# EAGLE design manual4 (EAGLE 9.0.1)
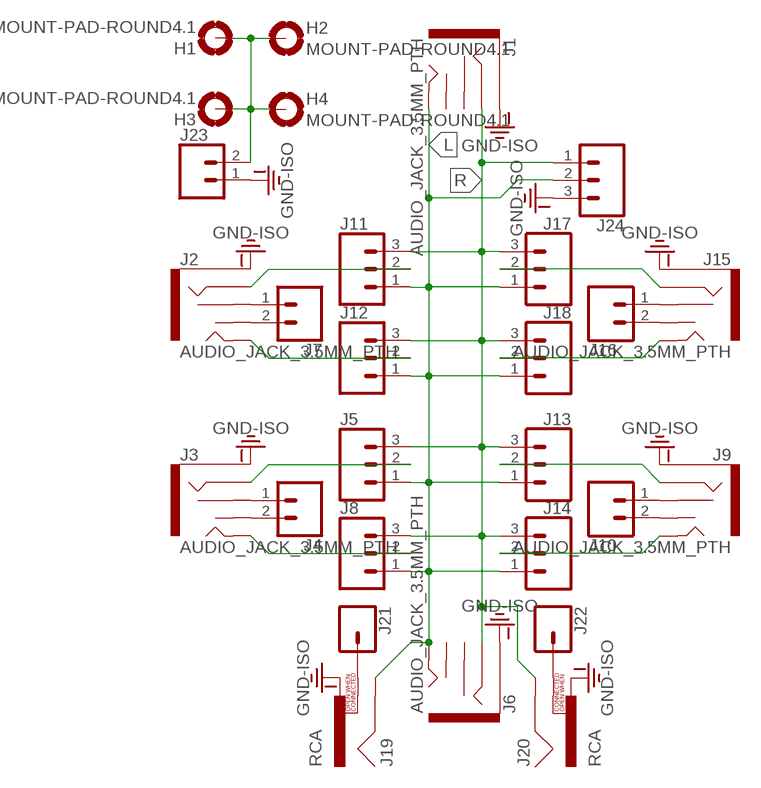
[diagram p0: schematic, sheet 1]

## Parts
H1  MOUNT-PAD-ROUND4.1  [4,1-PAD]
H2  MOUNT-PAD-ROUND4.1  [4,1-PAD]
H3  MOUNT-PAD-ROUND4.1  [4,1-PAD]
H4  MOUNT-PAD-ROUND4.1  [4,1-PAD]
J1  AUDIO_JACK_3.5MM_PTH  [AUDIO-JACK]
J2  AUDIO_JACK_3.5MM_PTH  [AUDIO-JACK]
J3  AUDIO_JACK_3.5MM_PTH  [AUDIO-JACK]
J4  CONN_02  [1X02]
J5  CONN_03  [1X03]
J6  AUDIO_JACK_3.5MM_PTH  [AUDIO-JACK]
J7  CONN_02  [1X02]
J8  CONN_03  [1X03]
J9  AUDIO_JACK_3.5MM_PTH  [AUDIO-JACK]
J10  CONN_02  [1X02]
J11  CONN_03  [1X03]
J12  CONN_03  [1X03]
J13  CONN_03  [1X03]
J14  CONN_03  [1X03]
J15  AUDIO_JACK_3.5MM_PTH  [AUDIO-JACK]
J16  CONN_02  [1X02]
J17  CONN_03  [1X03]
J18  CONN_03  [1X03]
J19  RCA  [RCA]
J20  RCA  [RCA]
J21  CONN_01  [1X01]
J22  CONN_01  [1X01]
J23  CONN_02  [1X02]
J24  CONN_03  [1X03]

## Nets
GND-ISO: J1.SLEEVE J2.SLEEVE J3.SLEEVE J6.SLEEVE J9.SLEEVE J15.SLEEVE J19.PIN J20.PIN J23.1 J24.3
L: J1.TIP J5.1 J6.TIP J8.1 J11.1 J12.1 J13.1 J14.1 J17.1 J18.1 J19.SHELL J24.2
N$1: J2.RSH J7.1
N$2: J2.TSH J7.2
N$3: J2.RING J11.2
N$4: J2.TIP J12.2
N$5: J3.RSH J4.1
N$6: J3.TSH J4.2
N$7: J3.RING J5.2
N$8: J3.TIP J8.2
N$9: J9.RSH J10.1
N$10: J9.TSH J10.2
N$11: J9.RING J13.2
N$12: J9.TIP J14.2
N$13: J15.RSH J16.1
N$14: J15.TSH J16.2
N$15: J15.RING J17.2
N$16: J15.TIP J18.2
N$17: J19.SWITCH J21.1
N$18: J20.SWITCH J22.1
N$19: H1.B4,1(MOUNT) H2.B4,1(MOUNT) H3.B4,1(MOUNT) H4.B4,1(MOUNT) J23.2
R: J1.RING J5.3 J6.RING J8.3 J11.3 J12.3 J13.3 J14.3 J17.3 J18.3 J20.SHELL J24.1
Unconnected: J1.RSH J1.TSH J6.RSH J6.TSH

## Library data of the parts
H1-H4 = holes:MOUNT-PAD-ROUND: MOUNTING PAD, round
J1-J3 J6 J9 J15 = SparkFun-Connectors:AUDIO_JACK_3.5MM: Audio Jack 3.5mm variants of PTH and SMT stereo audio jack with bypass switches. SparkFun Products: SparkFun SparkPunk Sound Kit <[https://www.sparkfun.com/products/11177]> - PTH MP3 Trigger <https://www.sparkfun.com/products/13720> -3.5mm SMD SparkFun PicoBoard <https://www.sparkfun.com/products/11888>- 2.5mm SMD; PROD_ID: CONN-08774; SF_ID: PRT-08032
J4 J7 J10 J16 J23 = SparkFun-Connectors:CONN_02: Multi connection point. Often used as Generic Header-pin footprint for 0.1 inch spaced/style header connections On any of the 0.1 inch spaced packages, you can populate with these: Break Away Headers - Straight <https://www.sparkfun.com/products/116> (PRT-00116) Break Away Male Headers - Right Angle <https://www.sparkfun.com/products/553> (PRT-00553) Female Headers <https://www.sparkfun.com/products/115> (PRT-00115) Break Away Headers - Machine Pin <https://www.sparkfun.com/products/117> (PRT-00117) Break Away Female Headers - Swiss Machine Pin <https://www.sparkfun.com/products/743> (PRT-00743) For SCREWTERMINALS and SPRING TERMINALS visit here: Screw Terimnals on SparkFun.com <https://www.sparkfun.com/search/results?term=Screw+Terminals> (5mm/3.5mm/2.54mm spacing) This device is also useful as a general connection point to wire up your design to another part of your project. Our various solder wires solder well into these plated through hole pads. Hook-Up Wire - Assortment (Stranded, 22 AWG) <https://www.sparkfun.com/products/11375> (PRT-11375) Hook-Up Wire - Assortment (Solid Core, 22 AWG) <https://www.sparkfun.com/products/11367> (PRT-11367) View the entire wire category on our website here <https://www.sparkfun.com/categories/141> Special notes: Molex polarized connector foot print use with: PRT-08233 with associated crimp pins and housings. 2.54_SCREWTERM for use with PRT-10571. 3.5mm Screw Terminal footprints for PRT-08084 5mm Screw Terminal footprints for use with PRT-08432
J5 J8 J11-J14 J17 J18 J24 = SparkFun-Connectors:CONN_03: Multi connection point. Often used as Generic Header-pin footprint for 0.1 inch spaced/style header connections On any of the 0.1 inch spaced packages, you can populate with these: Break Away Headers - Straight <https://www.sparkfun.com/products/116> (PRT-00116) Break Away Male Headers - Right Angle <https://www.sparkfun.com/products/553> (PRT-00553) Female Headers <https://www.sparkfun.com/products/115> (PRT-00115) Break Away Headers - Machine Pin <https://www.sparkfun.com/products/117> (PRT-00117) Break Away Female Headers - Swiss Machine Pin <https://www.sparkfun.com/products/743> (PRT-00743) Stackable Header - 3 Pin (Female, 0.1") <https://www.sparkfun.com/products/13875> (PRT-13875) For SCREWTERMINALS and SPRING TERMINALS visit here: Screw Terimnals on SparkFun.com <https://www.sparkfun.com/search/results?term=Screw+Terminals> (5mm/3.5mm/2.54mm spacing) This device is also useful as a general connection point to wire up your design to another part of your project. Our various solder wires solder well into these plated through hole pads. Hook-Up Wire - Assortment (Stranded, 22 AWG) <https://www.sparkfun.com/products/11375> (PRT-11375) Hook-Up Wire - Assortment (Solid Core, 22 AWG) <https://www.sparkfun.com/products/11367> (PRT-11367) View the entire wire category on our website here <https://www.sparkfun.com/categories/141> Special notes: Molex polarized connector foot print use with SKU : PRT-08232 with associated crimp pins and housings.
J19 J20 = SparkFun-Connectors:RCA: RCA Jack connector This is a right angle RCA jack connecotr. Commonly used for video or audio. Here is the connector we sell at SparkFun: RCA Jack <https://www.sparkfun.com/products/8631> (PRT-08631) Datasheet <http://www.sparkfun.com/datasheets/Prototyping/Connectors/RCA-Jack.pdf> It is not used on any active designs, however it was used on a couple retired products: RCA Jack Breakout [RETIRED] <https://www.sparkfun.com/products/8826> (PRT-08826) SparkFun On Screen Display Breakout - MAX7456 [RETIRED] <https://www.sparkfun.com/products/9168> (BOB-09168) You may also be interested in a cable: RCA Video Cable - 6' <https://www.sparkfun.com/products/11573> (CAB-11573); PROD_ID: CONN-09081; SF_ID: PRT-08631
J21 J22 = SparkFun-Connectors:CONN_01: Single connection point. Often used as Generic Header-pin footprint for 0.1 inch spaced/style header connections On any of the 0.1 inch spaced packages, you can populate with these: Break Away Headers - Straight <https://www.sparkfun.com/products/116> (PRT-00116) Break Away Male Headers - Right Angle <https://www.sparkfun.com/products/553> (PRT-00553) Female Headers <https://www.sparkfun.com/products/115> (PRT-00115) Break Away Headers - Machine Pin <https://www.sparkfun.com/products/117> (PRT-00117) Break Away Female Headers - Swiss Machine Pin <https://www.sparkfun.com/products/743> (PRT-00743) This device is also useful as a general connection point to wire up your design to another part of your project. Our various solder wires solder well into these plated through hole pads. Hook-Up Wire - Assortment (Stranded, 22 AWG) <https://www.sparkfun.com/products/11375> (PRT-11375) Hook-Up Wire - Assortment (Solid Core, 22 AWG) <https://www.sparkfun.com/products/11367> (PRT-11367) View the entire wire category on our website here <https://www.sparkfun.com/categories/141> Special notes: SMTSO-256-ET is a "flush mount" nut for a 4-40 screw. We mostly use this on specialty testbeds; it is a nice way to connect hardware to your PCB at an adjustable hieght. Also note, the SNAP packages are for using a snappable style connector. We sell a baggie of snaps and they are also used on two LilyPad designs: Snap Assortment - 30 pack (male and female) <https://www.sparkfun.com/products/11347> (DEV-11347) LilyPad Arduino SimpleSnap <https://www.sparkfun.com/products/10941> (DEV-10941) LilyPad SimpleSnap Protoboard <https://www.sparkfun.com/products/10940> (DEV-10940)

## Board
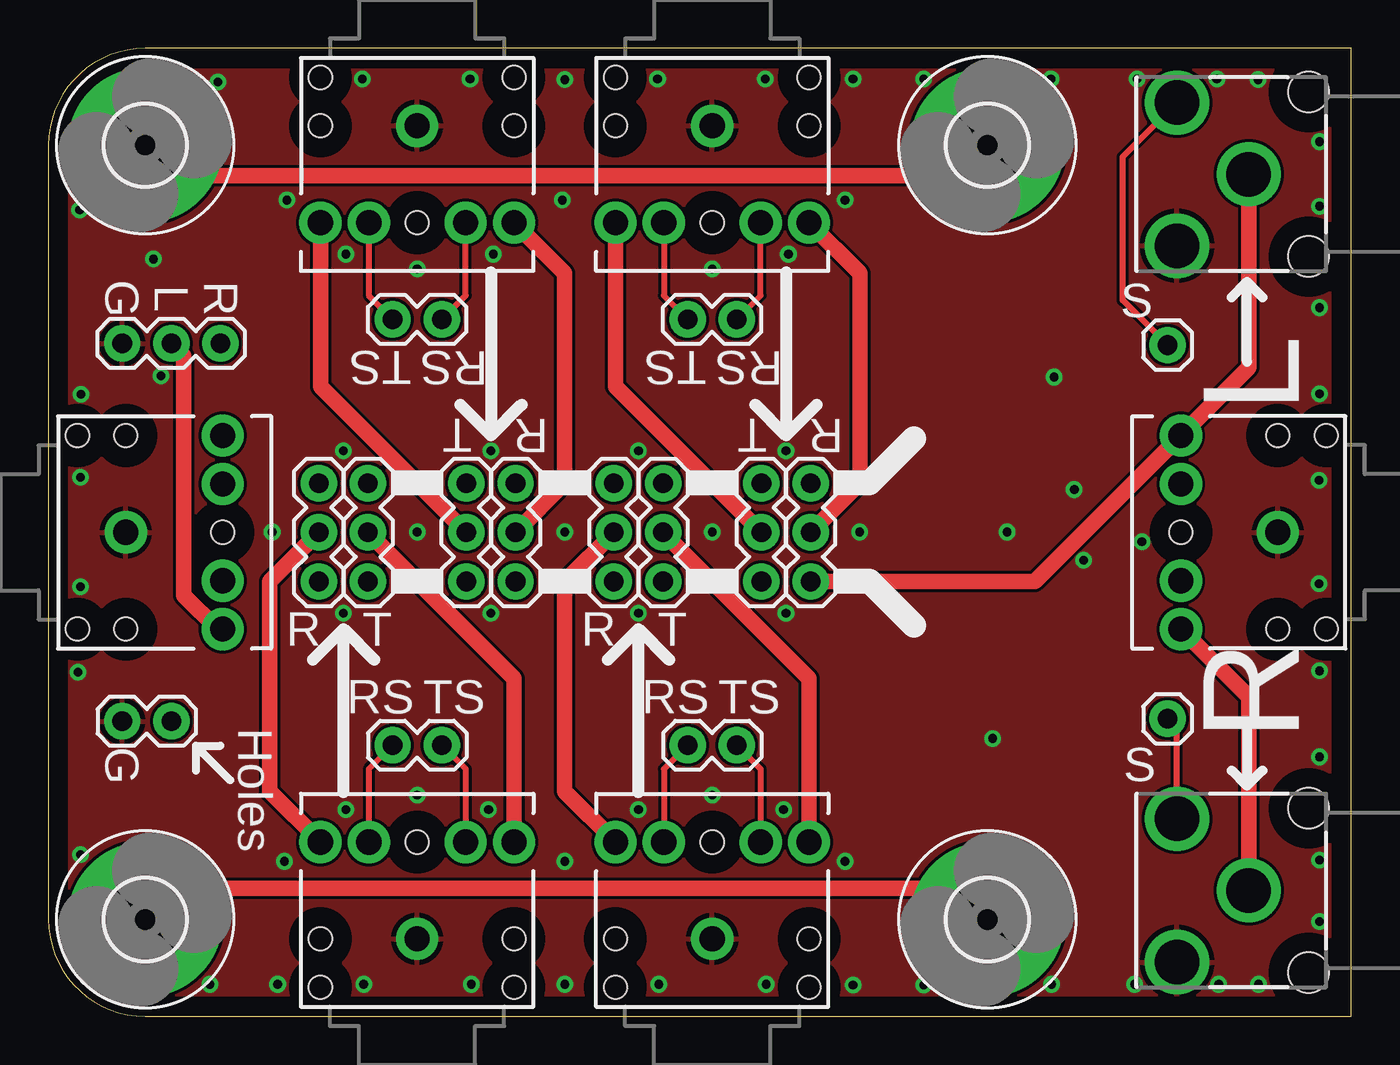
[diagram p1: board, top side]
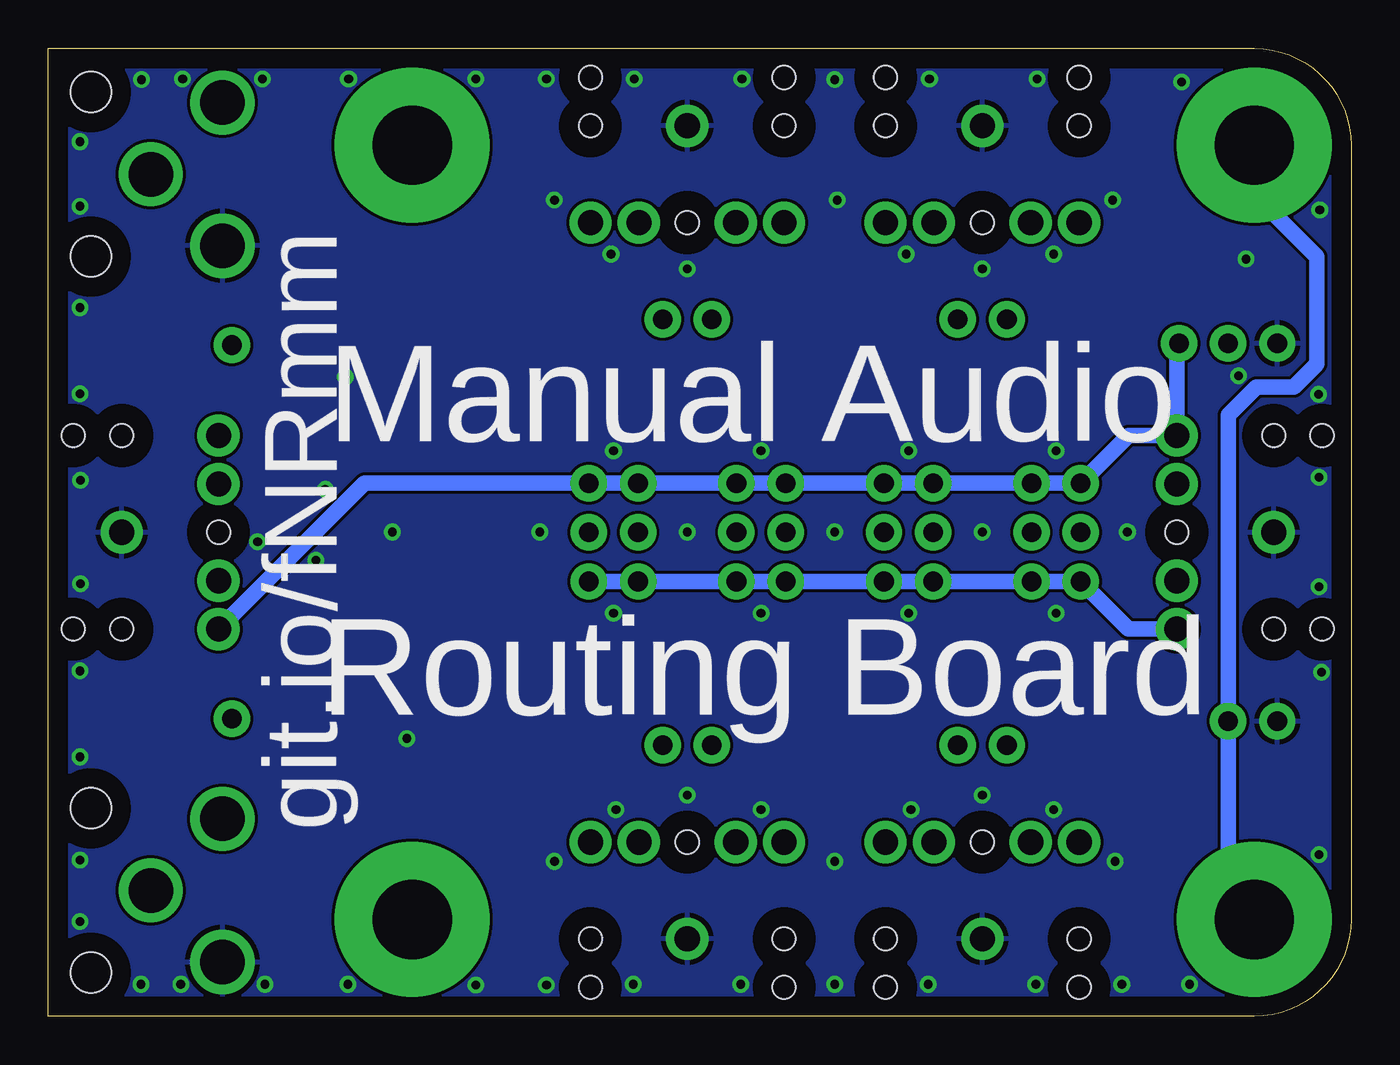
[diagram p2: board, bottom side, seen from below]

Size 67.29 x 50 mm. Coordinates in mm from the lower left corner, seen from the top.
Outline: 0,45 0,5 arc90 5,0 67.29,0 67.29,50 5,50 arc90 0,45
Copper layers (1*16): Top 0.035mm / dielectric 1.5mm / Bottom 0.035mm
Design rules "default *": minimum track width 6mil, minimum drill 0.35mm, track to track 6mil, track to pad 6mil, pad to pad 6mil, via to via 6mil, smd to smd 6mil, copper to edge 40mil, drill to drill 6mil, minimum pad ring 10mil, minimum via ring 8mil, stop-mask expansion 4mil, vias tented up to drill 18mil, thermal gap 10mil

### Footprints (pad centres in the part's own frame; a part is rotated, then mirrored left to right if it is on the bottom)
4,1-PAD = drill 4.1 pad 8: B4,1 0,0
AUDIO-JACK = drill 1.3 pad 2.184: RING 5,5; RSH 5,2.5; SLEEVE 0,0; TIP 5,-5; TSH 5,-2.5 | hole 1.2: 0,5; -2.5,5; -2.5,-5; 0,-5; 5,0
1X02 = drill 1.016 pad 1.88: 1 0,0; 2 2.54,0
1X03 = drill 1.016 pad 1.88: 1 0,0; 2 2.54,0; 3 5.08,0
RCA = drill 2.3: PIN 3.7,3.7; SHELL 0,0; SWITCH 3.7,-3.7 | hole 2.1: -3.1,4.25; -3.1,-4.25
1X01 = drill 1.016 pad 1.88: 1 0,0

### Placement (x,y rotation side)
H1  5,45 0 top
H2  5,5 0 top
H3  48.5,45 0 top
H4  48.5,5 0 top
J1  4,25 0 top
J2  19.05,46 270 top
J3  19.05,4 90 top
J4  17.78,14 0 top
J5  13.97,22.46 90 top
J6  63.5,25 180 top
J7  20.32,36 180 top
J8  16.51,22.46 90 top
J9  34.29,46 270 top
J10  35.56,36 180 top
J11  24.13,22.46 90 top
J12  21.59,22.46 90 top
J13  39.37,22.46 90 top
J14  36.83,22.46 90 top
J15  34.29,4 90 top
J16  33.02,14 0 top
J17  29.21,22.46 90 top
J18  31.75,22.46 90 top
J19  62,43.5 180 top
J20  62,6.5 180 top
J21  57.82,34.67 0 top
J22  57.82,15.37 0 top
J23  3.81,15.24 0 top
J24  8.89,34.76 180 top

### Tracks (layer width: path | path; a pad name or v marks a point on that pad's centre or on a via)
GND-ISO  (via drill 0.45)
  other vias: 26.67,1.65 26.67,8 12.19,8 41.15,8 48.77,14.35 51.94,33.02 15.24,29.21 22.86,29.21 30.48,29.21 38.1,29.21 34.29,25.02 41.91,25.02 49.53,25.02 22.86,20.83 15.24,20.83 30.48,20.83 38.1,20.83 41.15,42.16 26.54,42.16 12.32,42.16 15.37,39.37 22.99,39.37 38.23,39.37 37.97,10.67 30.48,10.67 22.73,10.67 15.37,10.67 45.21,1.62 51.82,1.65 62.52,1.65 65.66,8.06 65.66,17.84 53.47,23.56 65.66,36.61 65.66,45.18 62.48,48.39 51.78,48.42 45.21,48.42 34.29,38.61 19.05,38.61 26.67,48.39 8.76,48.26 1.62,41.66 1.68,32.13 1.65,27.84 1.65,22.19 1.52,17.78 1.65,8.35 8.35,1.65 19.05,11.43 34.29,11.43 11.56,25.02 19.05,25.02 26.67,25.02 5.81,33.08 52.99,27.21 56.48,24.51 65.63,27.69 65.63,22.35 16.29,1.65 21.84,1.65 31.53,1.65 37.08,1.65 16.22,48.42 21.78,48.42 31.46,48.42 37.02,48.42 41.56,48.42 56.23,48.42 60.36,48.42 65.66,41.85 65.66,32.16 65.66,13.4 65.66,4.89 60.45,1.65 56.1,1.65 41.56,1.62 11.84,1.65 5.43,39.12
  pour Bottom: 0,0 67.31,0 67.31,49.53 0,49.53
  pour Top: 0,0 67.31,0 67.31,49.53 0,49.53
L
  Top 0.813: J19.SHELL 62,33.5 J6.TIP 50.96,22.46 J13.1 | J1.TIP 8.73,20 6.99,21.75 6.99,34.12 J24.2
  Bottom 0.813: J1.TIP 11.51,20 J5.1 J8.1 J12.1 J11.1 J17.1 J18.1 J14.1 J13.1
N$1
  Top 0.305: J7.1 21.55,37.23 J2.RSH
N$2
  Top 0.305: J2.TSH 16.55,37.23 J7.2
N$3
  Top 0.813: J11.2 26.67,27.54 26.67,38.38 J2.RING
N$4
  Top 0.813: J12.2 14.05,32.54 J2.TIP
N$5
  Top 0.305: J4.1 16.55,12.77 J3.RSH
N$6
  Top 0.305: J4.2 21.55,12.77 J3.TSH
N$7
  Top 0.813: J5.2 11.43,22.46 11.43,11.62 J3.RING
N$8
  Top 0.813: J3.TIP 24.05,17.46 J8.2
N$9
  Top 0.305: J10.1 36.79,37.23 J9.RSH
N$10
  Top 0.305: J9.TSH 31.79,37.23 J10.2
N$11
  Top 0.813: J13.2 41.91,27.54 41.91,38.38 J9.RING
N$12
  Top 0.813: J14.2 29.29,32.54 J9.TIP
N$13
  Top 0.305: J16.1 31.79,12.77 J15.RSH
N$14
  Top 0.305: J16.2 36.79,12.77 J15.TSH
N$15
  Top 0.813: J17.2 26.67,22.46 26.67,11.62 J15.RING
N$16
  Top 0.813: J15.TIP 39.29,17.46 J18.2
N$17
  Top 0.305: J21.1 55.5,36.99 55.5,44.4 J19.SWITCH
N$18
  Top 0.305: J20.SWITCH 58.3,14.88 J22.1
N$19
  Top 0.813: H2.B4,1 6.6,6.6 46.9,6.6 H4.B4,1 | H1.B4,1 6.57,43.43 46.93,43.43 H3.B4,1
  Bottom 0.813: H2.B4,1 6.35,6.35 J23.2 6.35,31.05 4.89,32.51 2.95,32.51 1.78,33.69 1.78,39.24 5,42.46 H1.B4,1
R
  Top 0.813: J20.SHELL 62,16.5 J6.RING
  Bottom 0.813: J6.RING 50.96,27.54 J13.3 J14.3 J18.3 J17.3 J11.3 J12.3 J8.3 J5.3 11.51,30 J1.RING 9,34.65 J24.1

### Text on the board
tPlace: G | L | R | S | TS | RS | TS | RS | L | T | R | T | R | R | T | R | T | RS | TS | RS | TS | R | G | S | Holes
bPlace: Manual Audio | git.io/fNRmm | Routing Board
tStop: R | L